# Altium schematic sheet MCU.SchDoc
size 420 x 297 mm; SheetNumber: 5; SheetTotal: 7
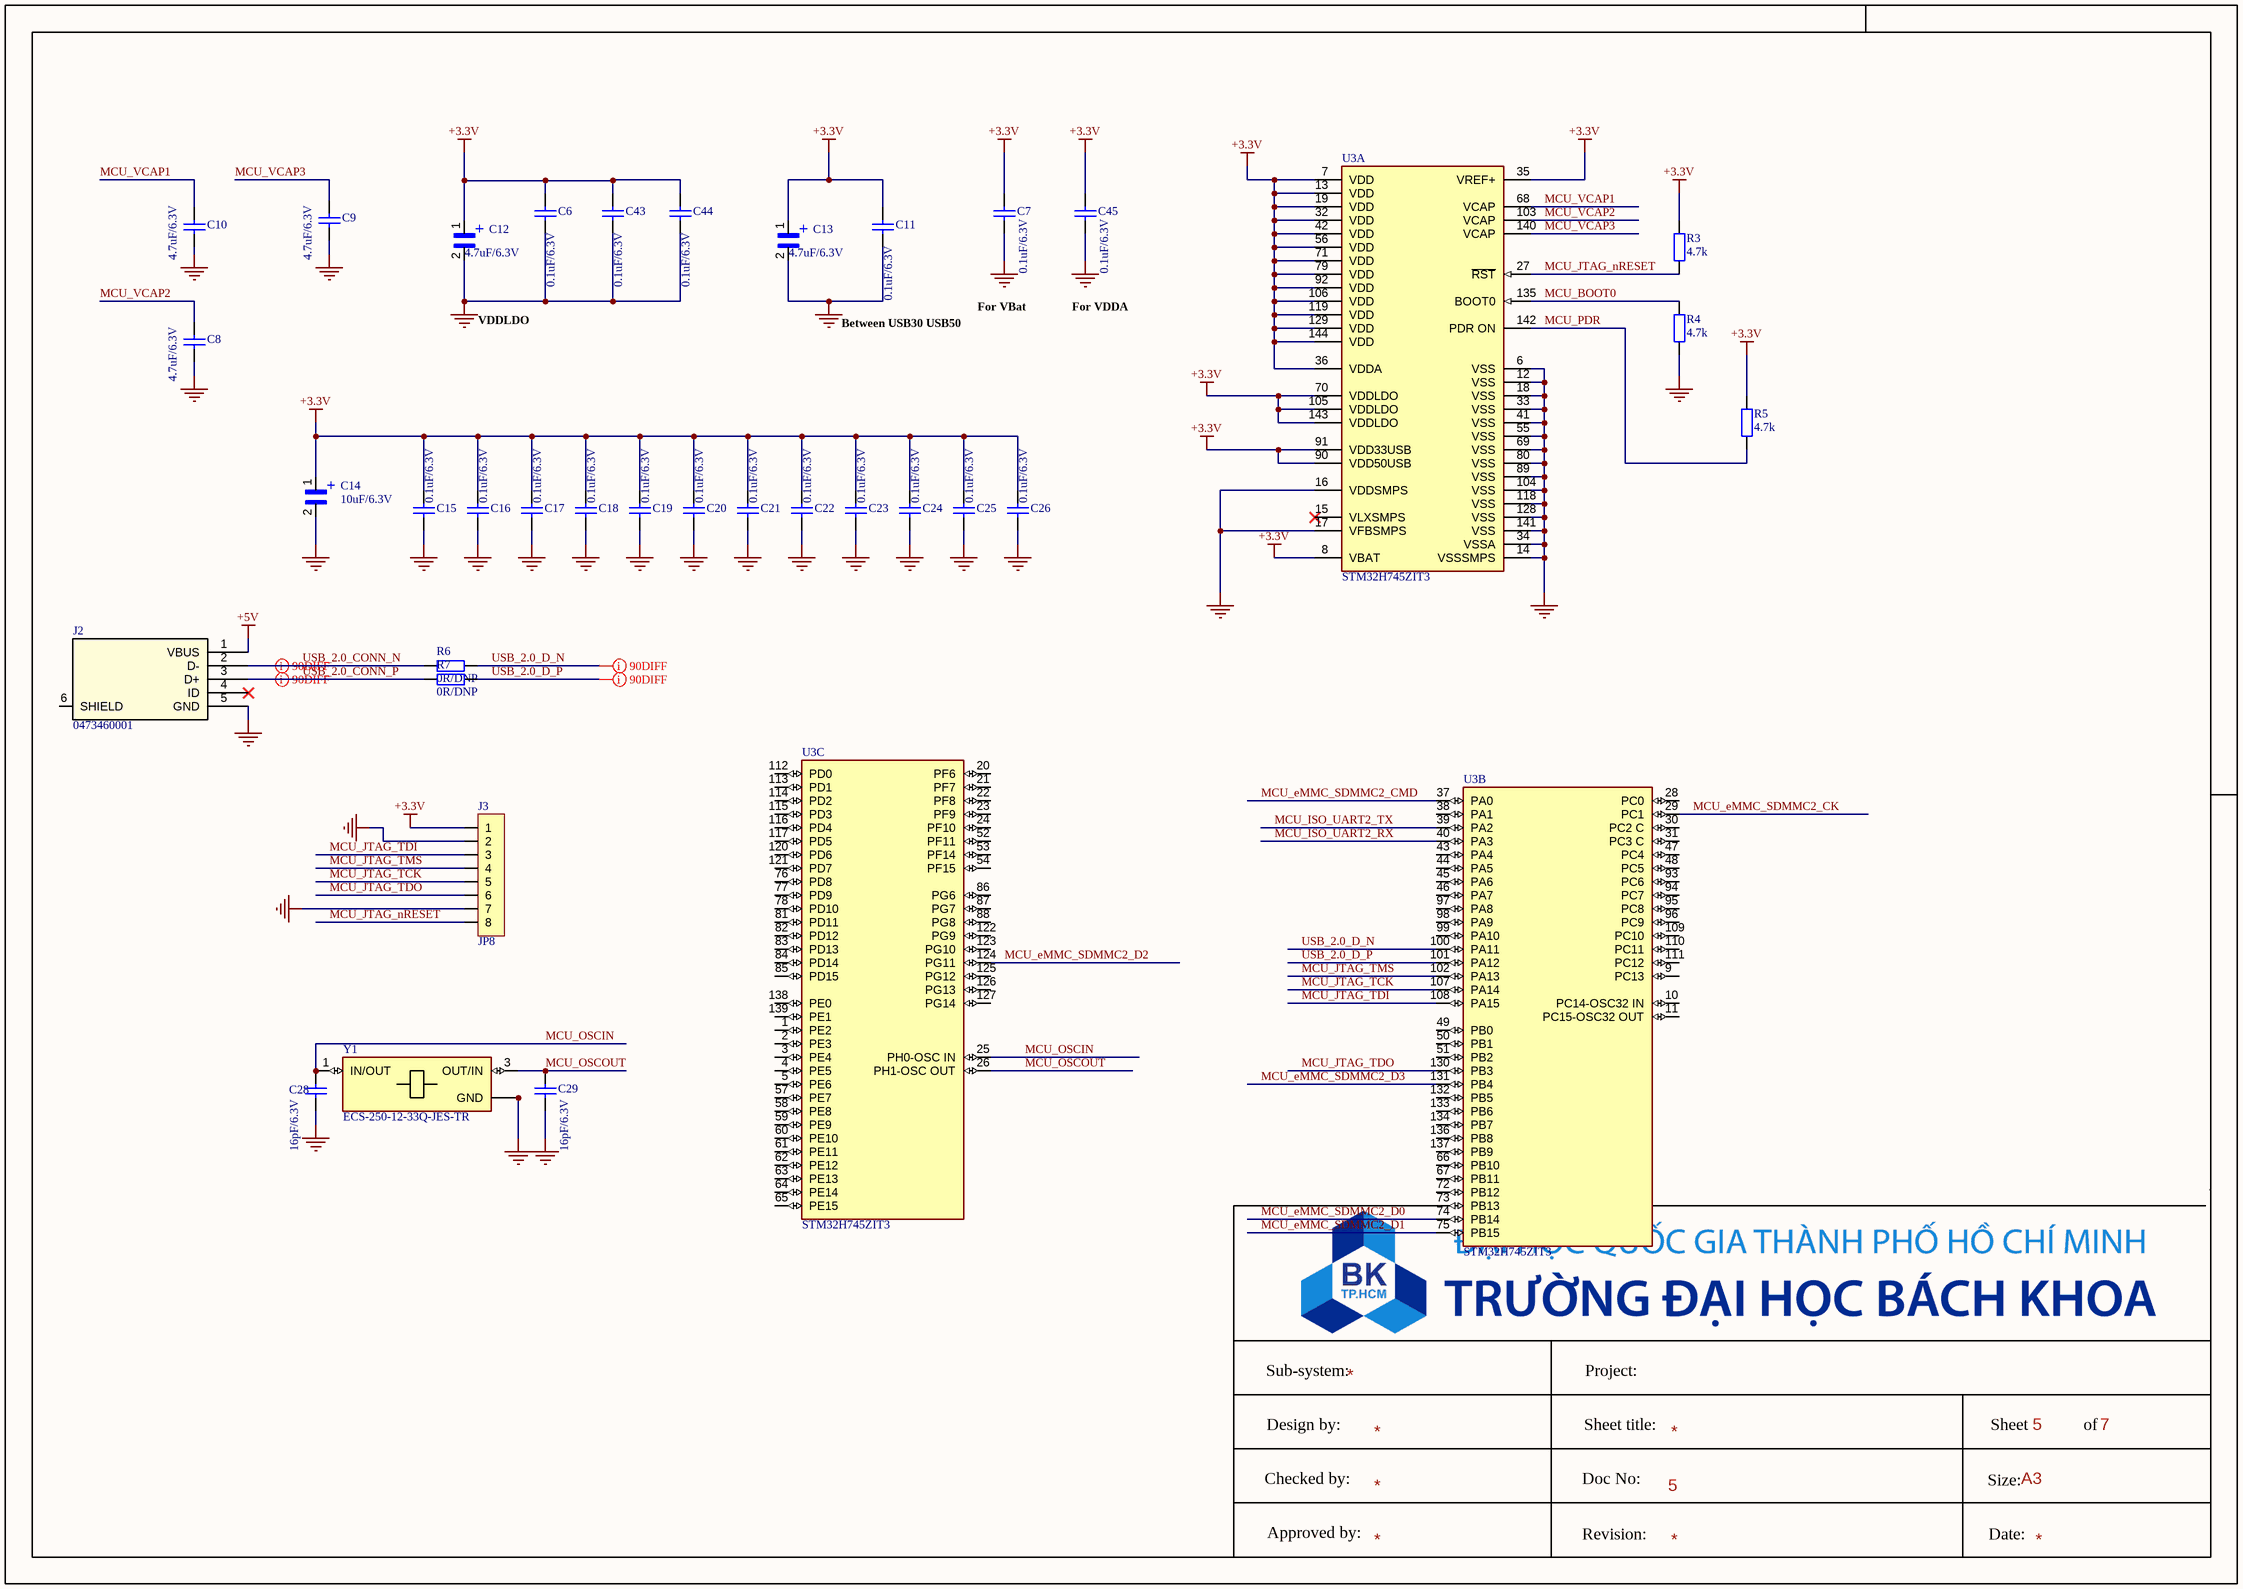
[diagram p0: MCU.SchDoc]

## Parts
C6  0.1uF/6.3V  [CAP_C_1608X80]
C7  0.1uF/6.3V  [CAP_C_1608X80]
C8  4.7uF/6.3V  [CAP_C_1608X80]
C9  4.7uF/6.3V  [CAP_C_1608X80]
C10  4.7uF/6.3V  [CAP_C_1608X80]
C11  0.1uF/6.3V  [CAP_C_1608X80]
C12  4.7uF/6.3V  [CAP_MP_1608X90]
C13  4.7uF/6.3V  [CAP_MP_1608X90]
C14  10uF/6.3V  [CAP_MP_2012X170]
C15  0.1uF/6.3V  [CAP_C_1608X80]
C16  0.1uF/6.3V  [CAP_C_1608X80]
C17  0.1uF/6.3V  [CAP_C_1608X80]
C18  0.1uF/6.3V  [CAP_C_1608X80]
C19  0.1uF/6.3V  [CAP_C_1608X80]
C20  0.1uF/6.3V  [CAP_C_1608X80]
C21  0.1uF/6.3V  [CAP_C_1608X80]
C22  0.1uF/6.3V  [CAP_C_1608X80]
C23  0.1uF/6.3V  [CAP_C_1608X80]
C24  0.1uF/6.3V  [CAP_C_1608X80]
C25  0.1uF/6.3V  [CAP_C_1608X80]
C26  0.1uF/6.3V  [CAP_C_1608X80]
C28  16pF/6.3V  [CAP_C_1608X80]
C29  16pF/6.3V  [CAP_C_1608X80]
C43  0.1uF/6.3V  [CAP_C_1608X80]
C44  0.1uF/6.3V  [CAP_C_1608X80]
C45  0.1uF/6.3V  [CAP_C_1608X80]
J2  0473460001  [47346-0001_MOL]
J3  JP8  [JP8-C1T]
R3  4.7k  [RES_C_1608X60]
R4  4.7k  [RES_C_1608X60]
R5  4.7k  [RES_C_1608X60]
R6  0R/DNP  [RES_C_1608X60]
R7  0R/DNP  [RES_C_1608X60]
U3  STM32H745ZIT3  [FP-LQFP144-1A-MFG]  (parts A,B,C of 3)
Y1  ECS-250-12-33Q-JES-TR  [XTAL_ECS-250-12-33Q-JES-TR]

## Nets
+3.3V: C6.1 C7.1 C11.1 C12.1 C13.1 C14.1 C15.1 C16.1 C17.1 C18.1 C19.1 C20.1 C21.1 C22.1 C23.1 C24.1 C25.1 C26.1 C43.1 C44.1 C45.1 J3.1 R3.1 R5.1 U3.7(VDD) U3.8(VBAT) U3.13(VDD) U3.19(VDD) U3.32(VDD) U3.35(VREF+) U3.36(VDDA) U3.42(VDD) U3.56(VDD) U3.70(VDDLDO) U3.71(VDD) U3.79(VDD) U3.90(VDD50USB) U3.91(VDD33USB) U3.92(VDD) U3.105(VDDLDO) U3.106(VDD) U3.119(VDD) U3.129(VDD) U3.143(VDDLDO) U3.144(VDD)
+5V: J2.1(VBUS)
GND: C6.2 C7.2 C8.2 C9.2 C10.2 C11.2 C12.2 C13.2 C14.2 C15.2 C16.2 C17.2 C18.2 C19.2 C20.2 C21.2 C22.2 C23.2 C24.2 C25.2 C26.2 C28.1 C29.1 C43.2 C44.2 C45.2 J2.5(GND) J3.2 J3.7 R4.1 U3.6(VSS) U3.12(VSS) U3.14(VSSSMPS) U3.16(VDDSMPS) U3.17(VFBSMPS) U3.18(VSS) U3.33(VSS) U3.34(VSSA) U3.41(VSS) U3.55(VSS) U3.69(VSS) U3.80(VSS) U3.89(VSS) U3.104(VSS) U3.118(VSS) U3.128(VSS) U3.141(VSS) Y1.2(GND) Y1.4(GND)
MCU_BOOT0: R4.2 U3.135(BOOT0)
MCU_eMMC_SDMMC2_CK: U3.29(PC1)
MCU_eMMC_SDMMC2_CMD: U3.37(PA0)
MCU_eMMC_SDMMC2_D0: U3.74(PB14)
MCU_eMMC_SDMMC2_D1: U3.75(PB15)
MCU_eMMC_SDMMC2_D2: U3.124(PG11)
MCU_eMMC_SDMMC2_D3: U3.131(PB4)
MCU_ISO_UART2_RX: U3.40(PA3)
MCU_ISO_UART2_TX: U3.39(PA2)
MCU_JTAG_nRESET: J3.8 R3.2 U3.27(~{RST})
MCU_JTAG_TCK: J3.5 U3.107(PA14)
MCU_JTAG_TDI: J3.3 U3.108(PA15)
MCU_JTAG_TDO: J3.6 U3.130(PB3)
MCU_JTAG_TMS: J3.4 U3.102(PA13)
MCU_OSCIN: C28.2 U3.25(PH0-OSC_IN) Y1.1(IN/OUT)
MCU_OSCOUT: C29.2 U3.26(PH1-OSC_OUT) Y1.3(OUT/IN)
MCU_PDR: R5.2 U3.142(PDR_ON)
MCU_VCAP1: C10.1 U3.68(VCAP)
MCU_VCAP2: C8.1 U3.103(VCAP)
MCU_VCAP3: C9.1 U3.140(VCAP)
USB_2.0_CONN_N: J2.2(D-) R6.1
USB_2.0_CONN_P: J2.3(D+) R7.1
USB_2.0_D_N: R6.2 U3.100(PA11)
USB_2.0_D_P: R7.2 U3.101(PA12)

Not connected (* = marked no-connect by the designer): J2 4(ID)* 6(SHIELD); U3 1(PE2) 2(PE3) 3(PE4) 4(PE5) 5(PE6) 9(PC13) 10(PC14-OSC32_IN) 11(PC15-OSC32_OUT) 15(VLXSMPS)* 20(PF6) 21(PF7) 22(PF8) 23(PF9) 24(PF10) 28(PC0) 30(PC2_C) 31(PC3_C) 38(PA1) 43(PA4) 44(PA5) 45(PA6) 46(PA7) 47(PC4) 48(PC5) 49(PB0) 50(PB1) 51(PB2) 52(PF11) 53(PF14) 54(PF15) 57(PE7) 58(PE8) 59(PE9) 60(PE10) 61(PE11) 62(PE12) 63(PE13) 64(PE14) 65(PE15) 66(PB10) 67(PB11) 72(PB12) 73(PB13) 76(PD8) 77(PD9) 78(PD10) 81(PD11) 82(PD12) 83(PD13) 84(PD14) 85(PD15) 86(PG6) 87(PG7) 88(PG8) 93(PC6) 94(PC7) 95(PC8) 96(PC9) 97(PA8) 98(PA9) 99(PA10) 109(PC10) 110(PC11) 111(PC12) 112(PD0) 113(PD1) 114(PD2) 115(PD3) 116(PD4) 117(PD5) 120(PD6) 121(PD7) 122(PG9) 123(PG10) 125(PG12) 126(PG13) 127(PG14) 132(PB5) 133(PB6) 134(PB7) 136(PB8) 137(PB9) 138(PE0) 139(PE1)

## Layout directives
differential pair; differential pair class DIFF90: USB_2.0_CONN_N, USB_2.0_CONN_P, USB_2.0_D_N, USB_2.0_D_P

## Notes on the sheet
- VDDLDO
- Between USB30 USB50
- For VBat
- For VDDA
- Sub-system:
- Project:
- Design by:
- Sheet title:
- Sheet
- of
- Checked by:
- Approved by:
- Doc No:
- Revision:
- Size:
- Date:
- A3
- (in symbol TACL335M003RTA) +
- (in symbol TACR686M003RTA) +

## Library data of the parts
C6 C8-C10 C43 C44 = Tu 0402 33nF 10V: 4.7 µF ±20% 6.3V Ceramic Capacitor X7T 0402 (1005 Metric): GRT155D70J475ME13J; Chung_Loai: Dán; Don_Vi: Con; So_Chan: 2; Ten_Linh_Kien: Tụ 0402 33nF X7R 10V GRM155R71A333KA01D; Ma_Hang: MH007853; Kieu_Chan: *
C7 C11 C15-C26 C28 C29 C45 = Tu 0402 33nF 10V: CAPC; Chung_Loai: Dán; Don_Vi: Con; So_Chan: 2; Ten_Linh_Kien: Tụ 0402 33nF X7R 10V GRM155R71A333KA01D; Ma_Hang: MH007853; Kieu_Chan: *
C12 C13 = TACL335M003RTA: CAPP; Package: None; Price: None; Value: *; MP: TACL335M003RTA; Availability: Unavailable
C14 = TACR686M003RTA: CAPP; MF: AVX; Availability: Unavailable; SnapEDA_Link: https://www.snapeda.com/parts/TACR686M003RTA/AVX/view-part/1745975/?ref=snap; MP: TACR686M003RTA; Value: *; Price: None; Package: 0805 AVX
J2 = USB_micro: No Description Available; Mfr_Name: Molex Connector Corporation; RefDes: RefDes; Type: Type
R3-R5 = Tro 0603 1% 10k: RES; Chung_Loai: Dán; Don_Vi: Con; So_Chan: 2; Ten_Linh_Kien: Trở 0603 1% 10k; Ma_Hang: MH006333; Kieu_Chan: *
R6 R7 = Tro 0603 1% 1k: RES SMD 12K OHM 1% 1/10W 0603, P/N: ERJ-3EKF1202V; Chung_Loai: Dán; So_Chan: 2; Don_Vi: Con; Ten_Linh_Kien: Trở 0603 1% 1k; Ma_Hang: MH006334; Kieu_Chan: *
U3 = CMP-12105-000054-1: HIGH-PERFORMANCE AND DSP WITH DP; Manufacturer Part Number: STM32H745ZIT6; Manufacturer: STMicroelectronics; Number Of Timers/Counters: 20; Min Supply Voltage: 1.62V; Frequency: 480MHz; Number Of I2C Channels: 4; Memory Type: FLASH; Number Of I/Os: 97; Number Of Pwm Channels: 42; Number Of Usb Channels: 2; Ram Size: 1MBytes; Memory Size: 2MBytes; Data Bus Width: 32bits; Number Of Adc Channels: 23; Number Of Ethernet Channels: 1; Number Of Uart Channels: 9; Interface: I2C,SPI,UART,USART,CAN,USB,LIN,IrDA,Ethernet,I2S,Other; Number Of A/D Converters: 3; Max Junction Temp: +125°C; Max Supply Voltage: 3.6V; Core Architecture: ARM Cortex-M4, Cortex-M7; Number Of Spi Channels: 6; Standoff Height: 0.05mm; Ambient Temperature Range Low: -40°C; Lead Free: Yes; Automotive: No; Height: 1.6mm; Device Class L1: Integrated Circuits (ICs); Ambient Temperature Range High: +85°C; RoHS: TRUE; Temperature Range High: +125°C; Temperature: -40°C to +125°C; Category: IC; Device Class L2: Embedded Processors and Controllers; Number Of Cores: 2; Temperature Range Low: -40°C; Octopart: https://octopart.com/stm32h745zit6-stmicroelectronics-100293939; Digikey Description: HIGH-PERFORMANCE AND DSP WITH DP; Package: LQFP144-1A; Device Class L3: Microcontrollers; ComponentLink2URL: https://www.st.com/resource/en/datasheet/stm32h745zi.pdf; ComponentLink2Description: Datasheet
Y1 = ECS-250-12-33Q-JES-TR: 25 MHz Â±20ppm Crystal 12pF 40 Ohms 4-SMD, No Lead; MF: ECS Inc.; Value: *; Purchase-URL: https://pricing.snapeda.com/search/part/ECS-250-12-33Q-JES-TR/?ref=eda; Package: ECS-33B ECS Inc.; Availability: In Stock; SnapEDA_Link: https://www.snapeda.com/parts/ECS-250-12-33Q-JES-TR/ECS+Inc./view-part/?ref=snap; MP: ECS-250-12-33Q-JES-TR; Check_prices: https://www.snapeda.com/parts/ECS-250-12-33Q-JES-TR/ECS+Inc./view-part/?ref=eda; Price: None